# Altium schematic sheet 00_Power_Diagram.SchDoc: Power Diagram
size A3; SheetNumber: 2; SheetTotal: 12
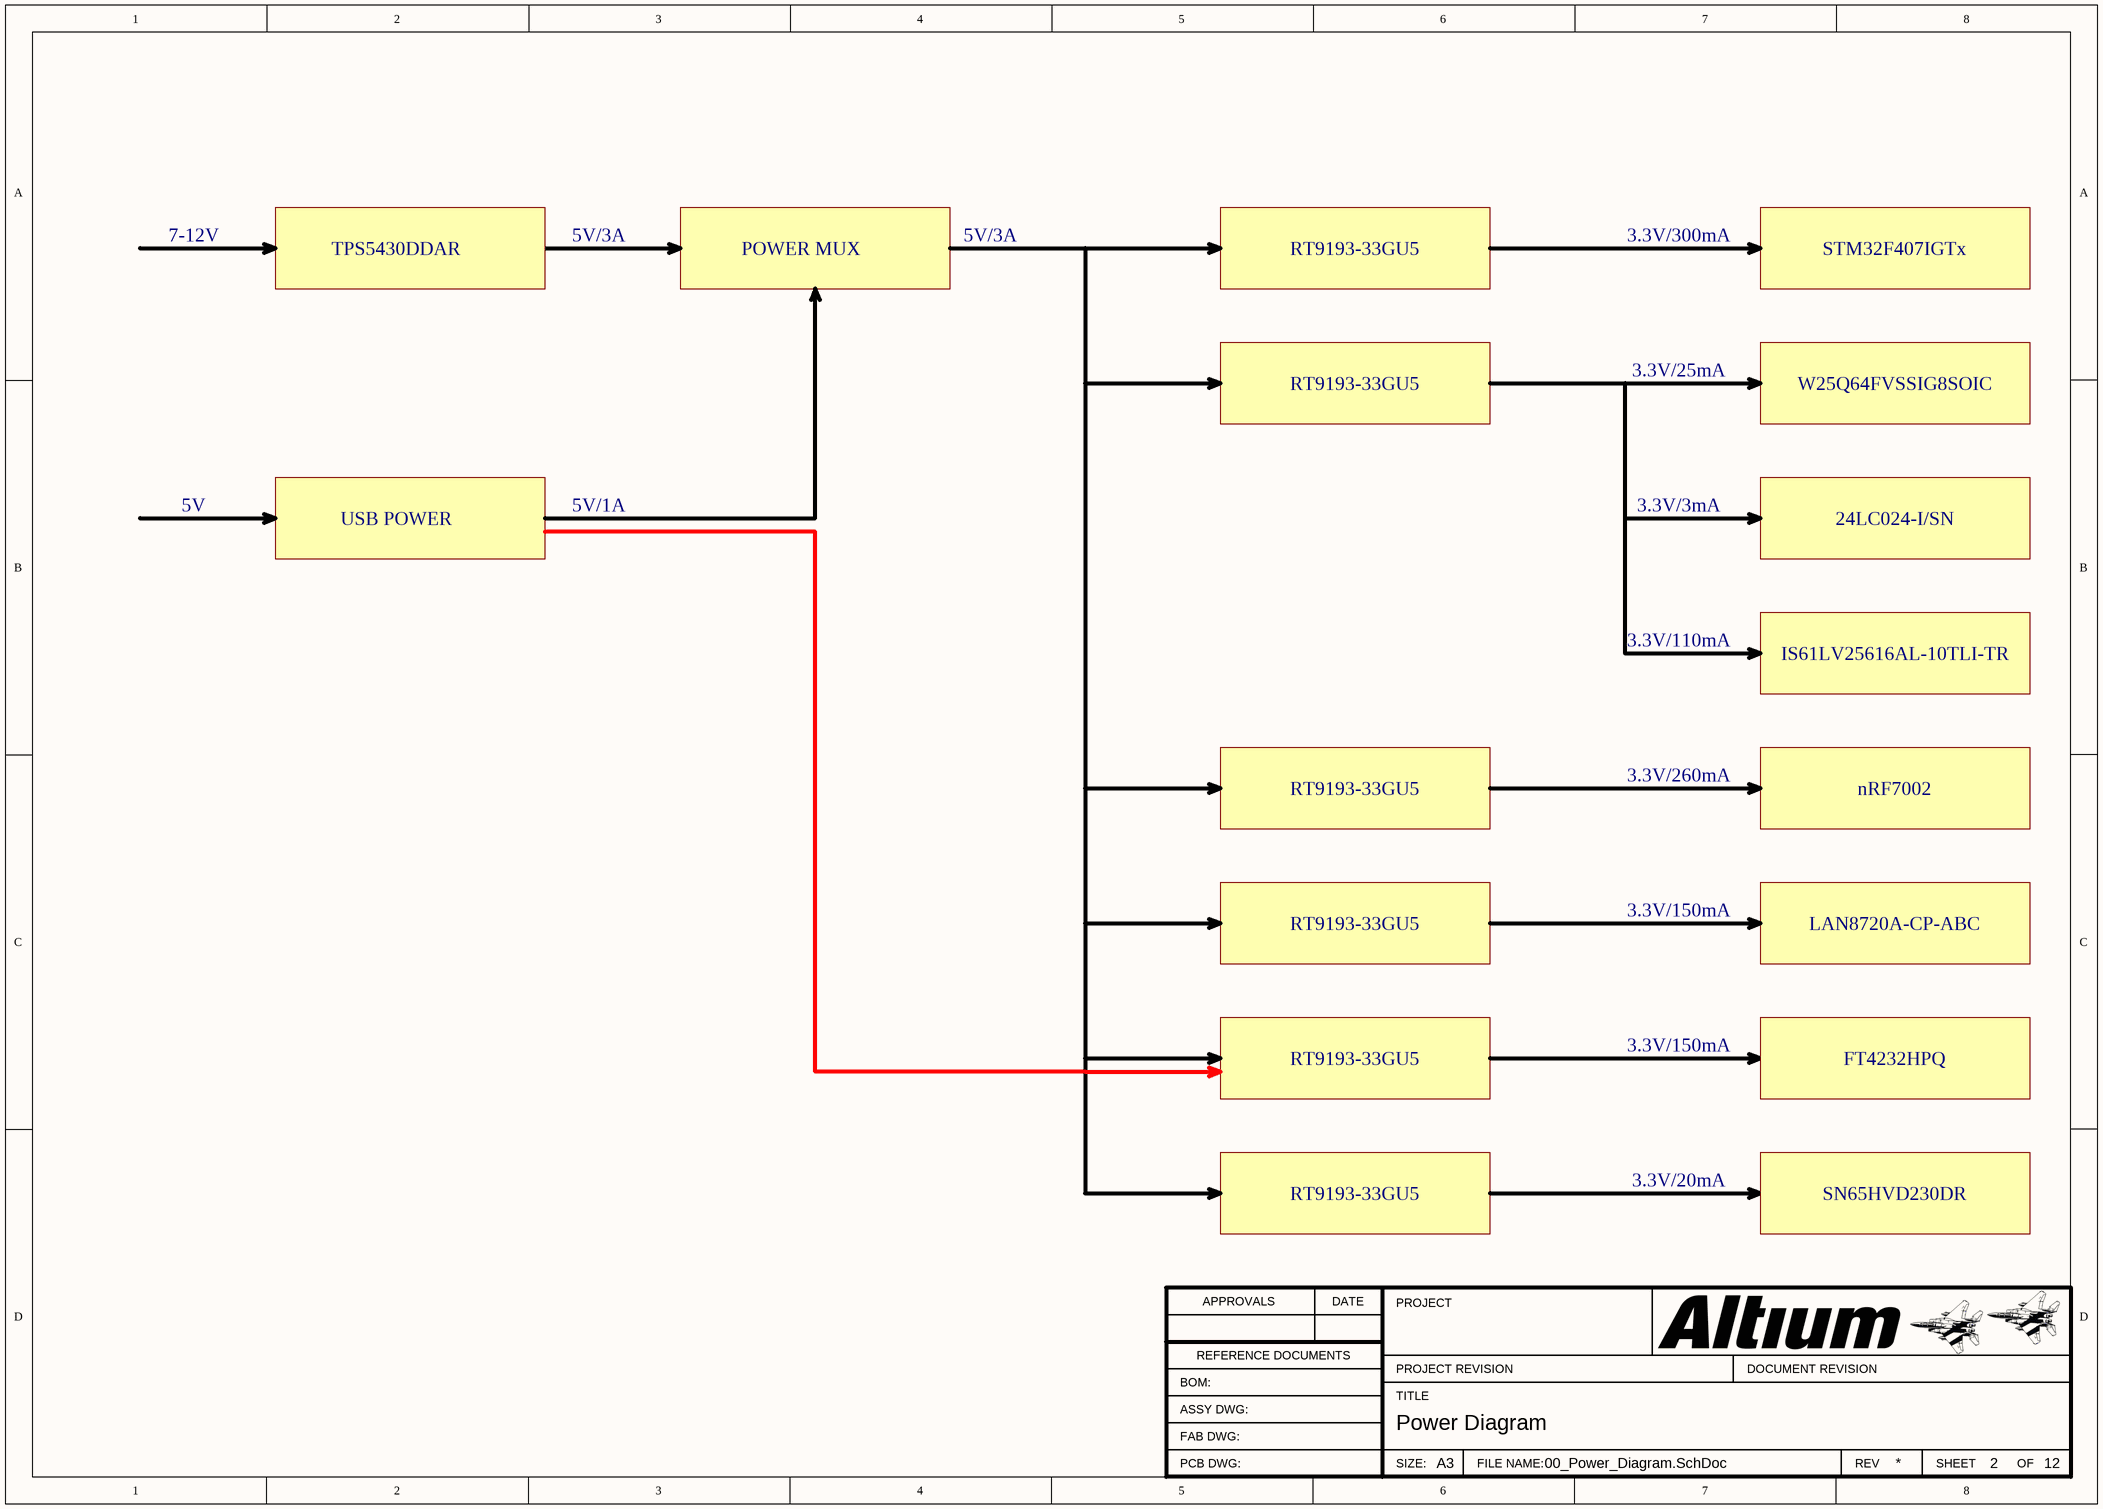
[diagram p0: 00_Power_Diagram.SchDoc]

## Notes on the sheet
- 7-12V
- TPS5430DDAR
- 5V/3A
- POWER MUX
- RT9193-33GU5
- 3.3V/300mA
- STM32F407IGTx
- 3.3V/25mA
- W25Q64FVSSIG8SOIC
- 5V
- USB POWER
- 5V/1A
- 3.3V/3mA
- 24LC024-I/SN
- 3.3V/110mA
- IS61LV25616AL-10TLI-TR
- 3.3V/260mA
- nRF7002
- 3.3V/150mA
- LAN8720A-CP-ABC
- FT4232HPQ
- 3.3V/20mA
- SN65HVD230DR
- APPROVALS
- DATE
- PROJECT
- BOM:
- REFERENCE DOCUMENTS
- TITLE
- PROJECT REVISION
- DOCUMENT REVISION
- ASSY DWG:
- FAB DWG:
- PCB DWG:
- SIZE:
- A3
- FILE NAME:
- REV
- SHEET
- OF